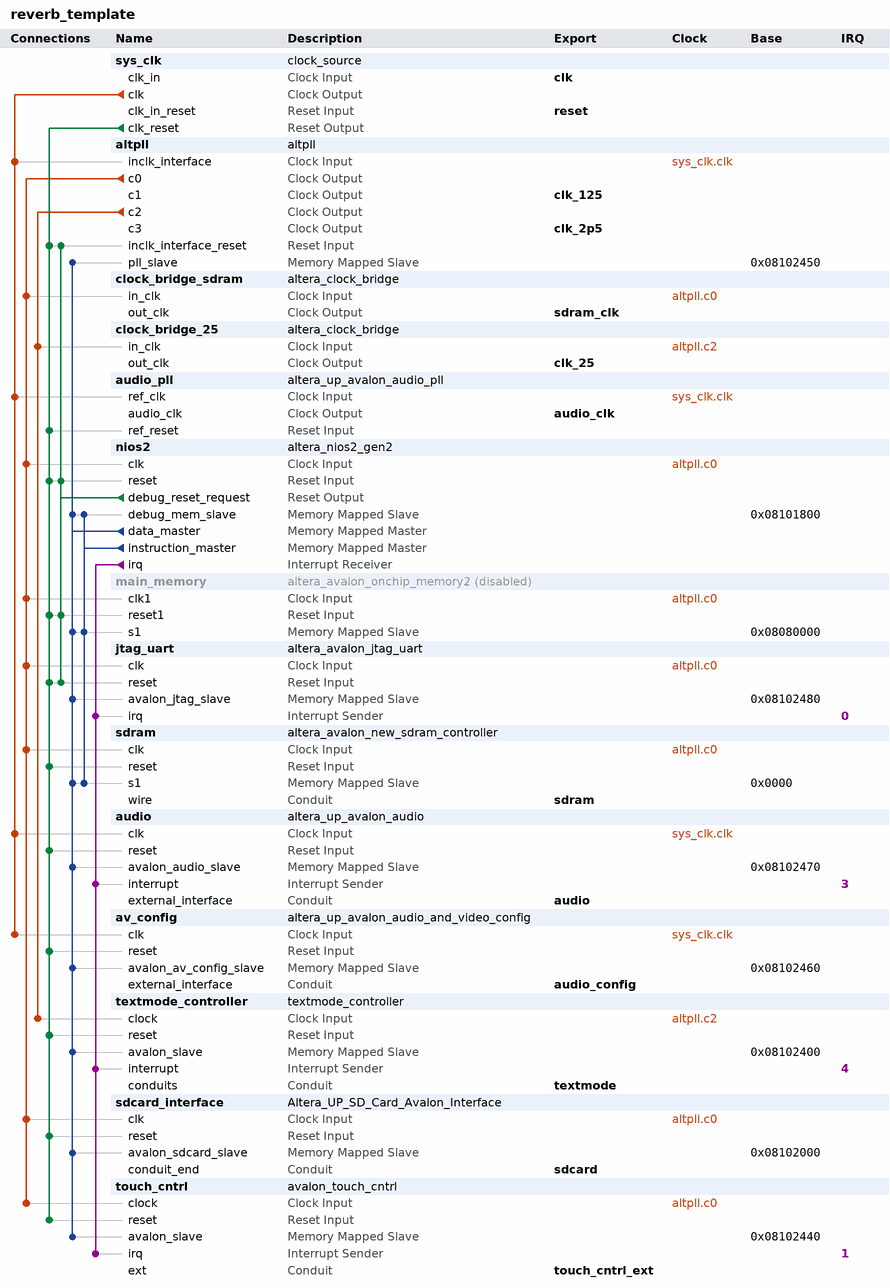
[diagram p0: system contents]
# Platform Designer (Qsys) system reverb_template, Cyclone IV E EP4CE115F29C7
# Parameters at their usual value, and those the tool derives, are not listed.
package require -exact qsys 18.1
create_system reverb_template
set_project_property DEVICE_FAMILY {Cyclone IV E}
set_project_property DEVICE EP4CE115F29C7

add_instance sys_clk clock_source 18.1
set_instance_parameter_value sys_clk clockFrequency 50000000

add_instance altpll altpll 18.1
set_instance_parameter_value altpll CLK0_DIVIDE_BY 1
set_instance_parameter_value altpll CLK0_MULTIPLY_BY 2
set_instance_parameter_value altpll CLK1_DIVIDE_BY 2
set_instance_parameter_value altpll CLK1_DUTY_CYCLE 50
set_instance_parameter_value altpll CLK1_MULTIPLY_BY 5
set_instance_parameter_value altpll CLK1_PHASE_SHIFT 0
set_instance_parameter_value altpll CLK2_DIVIDE_BY 2
set_instance_parameter_value altpll CLK2_DUTY_CYCLE 50
set_instance_parameter_value altpll CLK2_MULTIPLY_BY 1
set_instance_parameter_value altpll CLK2_PHASE_SHIFT 0
set_instance_parameter_value altpll CLK3_DIVIDE_BY 20
set_instance_parameter_value altpll CLK3_DUTY_CYCLE 50
set_instance_parameter_value altpll CLK3_MULTIPLY_BY 1
set_instance_parameter_value altpll CLK3_PHASE_SHIFT 0
set_instance_parameter_value altpll INCLK0_INPUT_FREQUENCY 20000
set_instance_parameter_value altpll PORT_ARESET PORT_UNUSED
set_instance_parameter_value altpll PORT_LOCKED PORT_UNUSED
set_instance_parameter_value altpll PORT_clk1 PORT_USED
set_instance_parameter_value altpll PORT_clk2 PORT_USED
set_instance_parameter_value altpll PORT_clk3 PORT_USED

add_instance clock_bridge_sdram altera_clock_bridge 18.1
set_instance_parameter_value clock_bridge_sdram DERIVED_CLOCK_RATE 100000000
set_instance_parameter_value clock_bridge_sdram EXPLICIT_CLOCK_RATE 0

add_instance clock_bridge_25 altera_clock_bridge 18.1
set_instance_parameter_value clock_bridge_25 DERIVED_CLOCK_RATE 25000000
set_instance_parameter_value clock_bridge_25 EXPLICIT_CLOCK_RATE 0

add_instance audio_pll altera_up_avalon_audio_pll 18.0
set_instance_parameter_value audio_pll gui_refclk 50.0

add_instance nios2 altera_nios2_gen2 18.1
set_instance_parameter_value nios2 dcache_size 2048
set_instance_parameter_value nios2 exceptionSlave sdram.s1
set_instance_parameter_value nios2 icache_size 2048
set_instance_parameter_value nios2 impl Fast
set_instance_parameter_value nios2 resetSlave sdram.s1
set_instance_parameter_value nios2 resetrequest_enabled false

add_instance main_memory altera_avalon_onchip_memory2 18.1
set_instance_property main_memory ENABLED false
set_instance_parameter_value main_memory dataWidth 32
set_instance_parameter_value main_memory dualPort false
set_instance_parameter_value main_memory initMemContent true
set_instance_parameter_value main_memory initializationFileName onchip_mem.hex
set_instance_parameter_value main_memory memorySize 307200

add_instance jtag_uart altera_avalon_jtag_uart 18.1
set_instance_parameter_value jtag_uart simInteractiveOptions NO_INTERACTIVE_WINDOWS

add_instance sdram altera_avalon_new_sdram_controller 18.1
set_instance_parameter_value sdram TAC 5.5
set_instance_parameter_value sdram TRCD 20.0
set_instance_parameter_value sdram TRP 20.0
set_instance_parameter_value sdram casLatency 3
set_instance_parameter_value sdram columnWidth 10
set_instance_parameter_value sdram dataWidth 32
set_instance_parameter_value sdram generateSimulationModel true
set_instance_parameter_value sdram model single_Micron_MT48LC4M32B2_7_chip
set_instance_parameter_value sdram numberOfBanks 4
set_instance_parameter_value sdram numberOfChipSelects 1
set_instance_parameter_value sdram powerUpDelay 100.0
set_instance_parameter_value sdram refreshPeriod 15.625
set_instance_parameter_value sdram rowWidth 13

add_instance audio altera_up_avalon_audio 18.0
set_instance_parameter_value audio audio_in true
set_instance_parameter_value audio avalon_bus_type {Memory Mapped}
set_instance_parameter_value audio dw 32

add_instance av_config altera_up_avalon_audio_and_video_config 18.0
set_instance_parameter_value av_config audio_in {Line In to ADC}
set_instance_parameter_value av_config bit_length 24
set_instance_parameter_value av_config board DE2-115
set_instance_parameter_value av_config line_in_bypass false
set_instance_parameter_value av_config sampling_rate {48 kHz}

add_instance textmode_controller textmode_controller 1.0
set_instance_parameter_value textmode_controller CLK_FREQ 25000000
set_instance_parameter_value textmode_controller COLUMN_COUNT 100
set_instance_parameter_value textmode_controller ROW_COUNT 30

add_instance sdcard_interface Altera_UP_SD_Card_Avalon_Interface 18.0

add_instance touch_cntrl avalon_touch_cntrl 1.0
set_instance_parameter_value touch_cntrl SYS_CLK 100000000

# connections
add_connection altpll.c0 clock_bridge_sdram.in_clk clock
add_connection altpll.c0 jtag_uart.clk clock
add_connection altpll.c0 main_memory.clk1 clock
add_connection altpll.c0 nios2.clk clock
add_connection altpll.c0 sdcard_interface.clk clock
add_connection altpll.c0 sdram.clk clock
add_connection altpll.c0 touch_cntrl.clock clock
add_connection altpll.c2 clock_bridge_25.in_clk clock
add_connection altpll.c2 textmode_controller.clock clock
add_connection sys_clk.clk altpll.inclk_interface clock
add_connection sys_clk.clk audio.clk clock
add_connection sys_clk.clk audio_pll.ref_clk clock
add_connection sys_clk.clk av_config.clk clock
add_connection nios2.debug_reset_request altpll.inclk_interface_reset reset
add_connection nios2.debug_reset_request jtag_uart.reset reset
add_connection nios2.debug_reset_request main_memory.reset1 reset
add_connection nios2.debug_reset_request nios2.reset reset
add_connection sys_clk.clk_reset altpll.inclk_interface_reset reset
add_connection sys_clk.clk_reset audio.reset reset
add_connection sys_clk.clk_reset audio_pll.ref_reset reset
add_connection sys_clk.clk_reset av_config.reset reset
add_connection sys_clk.clk_reset jtag_uart.reset reset
add_connection sys_clk.clk_reset main_memory.reset1 reset
add_connection sys_clk.clk_reset nios2.reset reset
add_connection sys_clk.clk_reset sdcard_interface.reset reset
add_connection sys_clk.clk_reset sdram.reset reset
add_connection sys_clk.clk_reset textmode_controller.reset reset
add_connection sys_clk.clk_reset touch_cntrl.reset reset
add_connection nios2.data_master altpll.pll_slave avalon
set_connection_parameter_value nios2.data_master/altpll.pll_slave baseAddress 0x08102450
add_connection nios2.data_master audio.avalon_audio_slave avalon
set_connection_parameter_value nios2.data_master/audio.avalon_audio_slave baseAddress 0x08102470
add_connection nios2.data_master av_config.avalon_av_config_slave avalon
set_connection_parameter_value nios2.data_master/av_config.avalon_av_config_slave baseAddress 0x08102460
add_connection nios2.data_master jtag_uart.avalon_jtag_slave avalon
set_connection_parameter_value nios2.data_master/jtag_uart.avalon_jtag_slave baseAddress 0x08102480
add_connection nios2.data_master main_memory.s1 avalon
set_connection_parameter_value nios2.data_master/main_memory.s1 baseAddress 0x08080000
add_connection nios2.data_master nios2.debug_mem_slave avalon
set_connection_parameter_value nios2.data_master/nios2.debug_mem_slave baseAddress 0x08101800
add_connection nios2.data_master sdcard_interface.avalon_sdcard_slave avalon
set_connection_parameter_value nios2.data_master/sdcard_interface.avalon_sdcard_slave baseAddress 0x08102000
add_connection nios2.data_master sdram.s1 avalon
set_connection_parameter_value nios2.data_master/sdram.s1 baseAddress 0x0000
add_connection nios2.data_master textmode_controller.avalon_slave avalon
set_connection_parameter_value nios2.data_master/textmode_controller.avalon_slave baseAddress 0x08102400
add_connection nios2.data_master touch_cntrl.avalon_slave avalon
set_connection_parameter_value nios2.data_master/touch_cntrl.avalon_slave baseAddress 0x08102440
add_connection nios2.instruction_master main_memory.s1 avalon
set_connection_parameter_value nios2.instruction_master/main_memory.s1 baseAddress 0x08080000
add_connection nios2.instruction_master nios2.debug_mem_slave avalon
set_connection_parameter_value nios2.instruction_master/nios2.debug_mem_slave baseAddress 0x08101800
add_connection nios2.instruction_master sdram.s1 avalon
set_connection_parameter_value nios2.instruction_master/sdram.s1 baseAddress 0x0000
add_connection nios2.irq audio.interrupt interrupt
set_connection_parameter_value nios2.irq/audio.interrupt irqNumber 3
add_connection nios2.irq jtag_uart.irq interrupt
set_connection_parameter_value nios2.irq/jtag_uart.irq irqNumber 0
add_connection nios2.irq textmode_controller.interrupt interrupt
set_connection_parameter_value nios2.irq/textmode_controller.interrupt irqNumber 4
add_connection nios2.irq touch_cntrl.irq interrupt
set_connection_parameter_value nios2.irq/touch_cntrl.irq irqNumber 1

# exported interfaces
add_interface audio conduit end
set_interface_property audio EXPORT_OF audio.external_interface
add_interface audio_clk clock source
set_interface_property audio_clk EXPORT_OF audio_pll.audio_clk
add_interface audio_config conduit end
set_interface_property audio_config EXPORT_OF av_config.external_interface
add_interface clk clock sink
set_interface_property clk EXPORT_OF sys_clk.clk_in
add_interface clk_125 clock source
set_interface_property clk_125 EXPORT_OF altpll.c1
add_interface clk_25 clock source
set_interface_property clk_25 EXPORT_OF clock_bridge_25.out_clk
add_interface clk_2p5 clock source
set_interface_property clk_2p5 EXPORT_OF altpll.c3
add_interface reset reset sink
set_interface_property reset EXPORT_OF sys_clk.clk_in_reset
add_interface sdcard conduit end
set_interface_property sdcard EXPORT_OF sdcard_interface.conduit_end
add_interface sdram conduit end
set_interface_property sdram EXPORT_OF sdram.wire
add_interface sdram_clk clock source
set_interface_property sdram_clk EXPORT_OF clock_bridge_sdram.out_clk
add_interface textmode conduit end
set_interface_property textmode EXPORT_OF textmode_controller.conduits
add_interface touch_cntrl_ext conduit end
set_interface_property touch_cntrl_ext EXPORT_OF touch_cntrl.ext

set_interconnect_requirement {$system} qsys_mm.clockCrossingAdapter HANDSHAKE
set_interconnect_requirement {$system} qsys_mm.enableEccProtection FALSE
set_interconnect_requirement {$system} qsys_mm.insertDefaultSlave FALSE
set_interconnect_requirement {$system} qsys_mm.maxAdditionalLatency 1

save_system reverb_template.qsys
